# Altium schematic sheet sensor.SchDoc
size A4; SheetNumber: 2; SheetTotal: 2
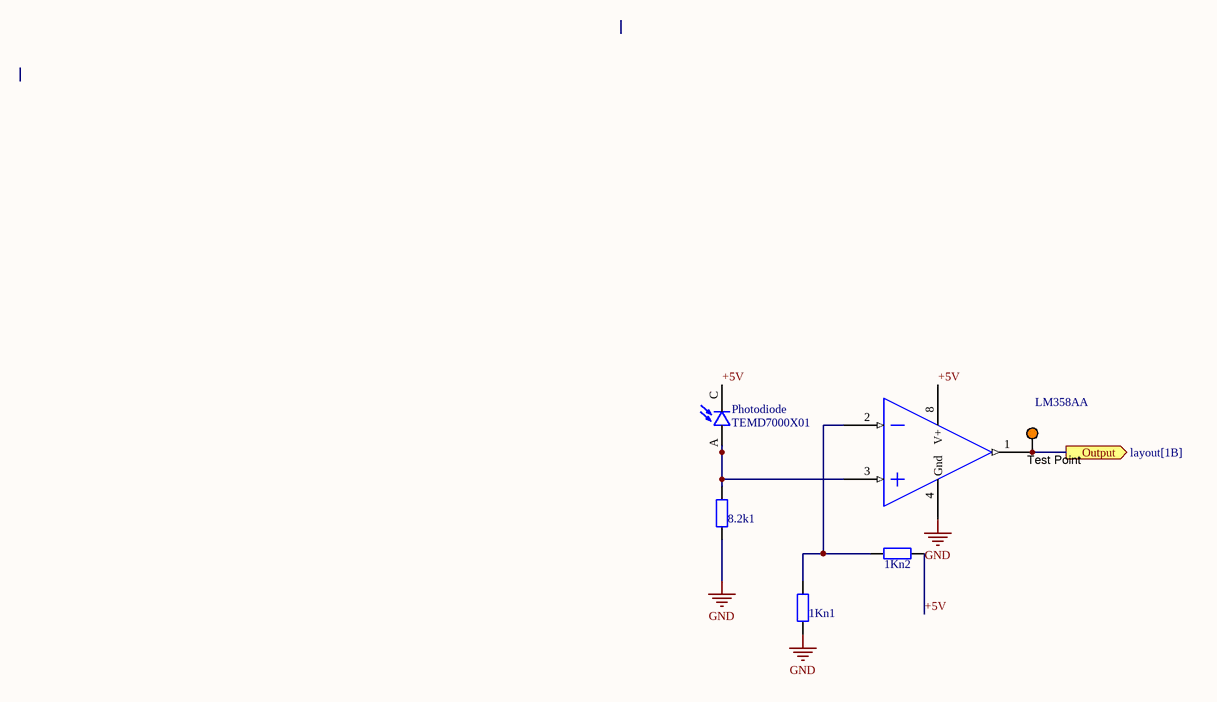
[diagram p0: sensor.SchDoc]

## Parts
1Kn1  1K  [ECE-RESA0.4TH]  (value not drawn)
1Kn2  1K  [ECE-RESA0.4TH]  (value not drawn)
8.2k1  8K2  [ECE-RESA0.4TH]  (value not drawn)
LM358A  LM358  [ECE-DIP8TH]  (value not drawn)  (part A of 2)
Photodiode  TEMD7000X01  [XDCR_TEMD7000X01]
Test_Point  5003  [TP_TH]  (value not drawn)

## Ports
Output (out, see layout[1B])

## Nets
GND: 1Kn1.1 8.2k1.1 LM358A.4(Gnd)
+5V: 1Kn2.2 LM358A.8(V+) Photodiode.C
Output: LM358A.1(OUT1) Test_Point.1 ; port Output
Net1Kn1_2: 1Kn1.2 1Kn2.1 LM358A.2(IN1(-))
Net8.2k1_2: 8.2k1.2 LM358A.3(IN1(+)) Photodiode.A

## Library data of the parts
1Kn1 1Kn2 = RES000037: RES MF 1K0 TH; Assembly Method: Through hole; Voltage/Current: 0.6W; Item Type: Item; Path: ece/ts/Lists/Stock Inventory; Value: 1K; UoA Stock#: RES000037; Size/Package: Axial 10mm; Supplier1: Active components; Supplier1-PN: T183997; Component Type: NA; Category: Resistor; Status: Active
8.2k1 = RES000048: RES MF 8K2 TH; Assembly Method: Through hole; Voltage/Current: 0.6W; Item Type: Item; Path: ece/ts/Lists/Stock Inventory; Value: 8K2; UoA Stock#: RES000048; Size/Package: Axial 10mm; Supplier1: Active components; Supplier1-PN: T184082; Component Type: NA; Category: Resistor; Status: Active
LM358A = OPA000005: IC OPAMP LM358 DUAL TH; Manufactuer: Fairchild; Manufacturer-PN: LM358N; Assembly Method: Through hole; Item Type: Item; Path: ece/ts/Lists/Stock Inventory; UoA Stock#: OPA000005; Value: LM358; Size/Package: DIP8; Datasheet Link: http://share.engineering.auckland.ac.nz/ece/ts/Student%20Documents/LM358.pdf; Supplier1: Digikey; Supplier1-PN: LM358NFS-ND; Supplier2: Active Components; Supplier2-PN: LM358N; Category: OpAmp; Status: Active
Photodiode = TEMD7000X01: Photodiode 900nm 100ns 120Â° 0805 (2012 Metric); MF: Vishay Semiconductor; Price: None; Purchase-URL: https://pricing.snapeda.com/search/part/TEMD7000X01/?ref=eda; Value: *; Check_prices: https://www.snapeda.com/parts/TEMD7000X01/Vishay+Semiconductor+Opto+Division/view-part/?ref=eda; Package: 0805 Vishay; SnapEDA_Link: https://www.snapeda.com/parts/TEMD7000X01/Vishay+Semiconductor+Opto+Division/view-part/?ref=snap; Availability: In Stock; MP: TEMD7000X01
Test_Point = TestPoint: Test Point, Orange, 1-Pin THD, RoHS; Peak Reverse Current: 600 uA; Forward Current: 3 A; Max Surge Current: 80 A; Forward Voltage: 1.08 V; Max Operating Temperature: 150 degC; PackageReference: 5003; Pins: 2; ComponentLink2URL: http://keyelco.com/userAssets/file/M65p56.pdf; PackageDescription: 1-Pin Through Hole Device, Dia 2.54 mm; Weight: 0.01 lb; Diameter: 5.3 mm; Mount: Through Hole; Package Quantity: 500; Packaging: Bulk; Min Operating Temperature: -65 degC; ComponentLink1Description: Manufacturer URL; Height: 0.25 inch; ComponentLink1URL: http://www.keyelco.com/; ComponentLink2Description: Datasheet; Width: 0.25 inch; REACH SVHC: No SVHC; RoHSCompliant: true; Radiation Hardening: No; Length: 9.5 mm; DatasheetVersion: Jun-15